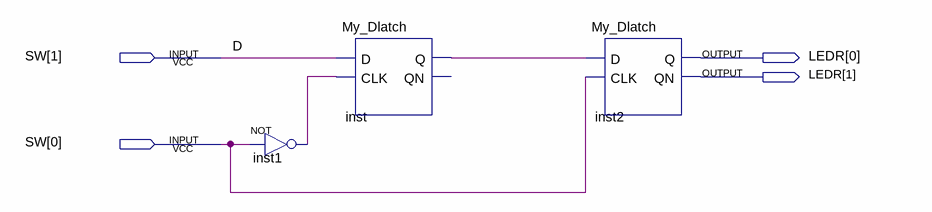
[diagram p0: schematic sheet]
// Quartus schematic lab4c.bdf as structural Verilog: 3 symbols, 4 pins
module lab4c (
  input  [1:0] SW,
  output [1:0] LEDR
);

  wire inst1_out, inst_q;

  not inst1 (inst1_out, SW[0]);
  My_Dlatch inst (.D(SW[1]), .CLK(inst1_out), .Q(inst_q));  // open: QN
  My_Dlatch inst2 (.D(inst_q), .CLK(SW[0]), .Q(LEDR[0]), .QN(LEDR[1]));

  // Other names for the same wires on the sheet: D = SW[1]
endmodule
